# EAGLE design Filter (EAGLE 7.6.0)
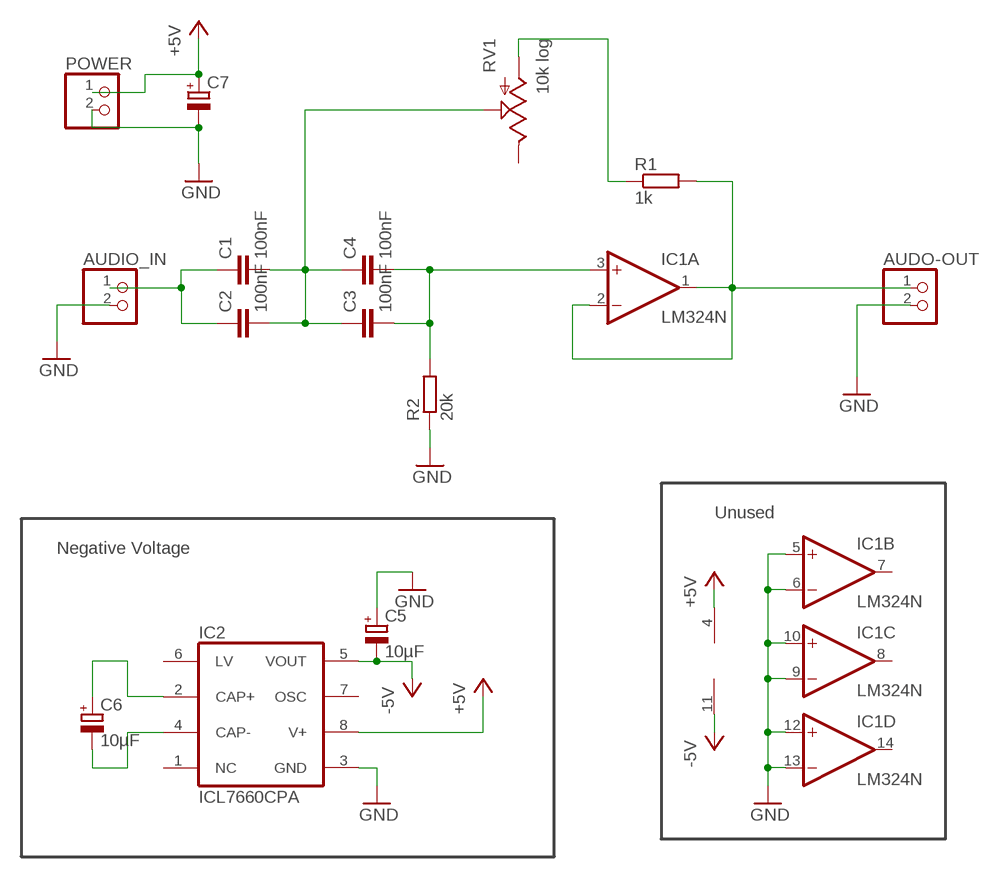
[diagram p0: schematic, sheet 1]

## Parts
AUDIO_IN  PINHD-1X2  [1X02]
AUDO-OUT  PINHD-1X2  [1X02]
C1  100nF  C-EU025-025X050  [C025-025X050]
C2  100nF  C-EU025-025X050  [C025-025X050]
C3  100nF  C-EU025-025X050  [C025-025X050]
C4  100nF  C-EU025-025X050  [C025-025X050]
C5  10µF  CPOL-EUE2.5-6  [E2,5-6]
C6  10µF  CPOL-EUE2.5-6  [E2,5-6]
C7  CPOL-EUE2.5-6  [E2,5-6]
IC1  LM324N  [DIL14]
IC2  ICL7660CPA  [DIL08]
POWER  PINHD-1X2  [1X02]
R1  1k  R-EU_0207/7  [0207/7]
R2  20k  R-EU_0207/7  [0207/7]
RV1  10k log  POT  [ALPS_POT]

## Nets
+5V: C7.+ IC1.4(P:V+) IC2.8(V+) POWER.1
-5V: C5.- IC1.11(P:V-) IC2.5(VOUT)
GND: AUDIO_IN.2 AUDO-OUT.2 C5.+ C7.- IC1.5(B:+IN) IC1.6(B:-IN) IC1.9(C:-IN) IC1.10(C:+IN) IC1.12(D:+IN) IC1.13(D:-IN) IC2.3(GND) POWER.2 R2.1
N$1: C3.2 C4.2 IC1.3(A:+IN) R2.2
N$2: AUDIO_IN.1 C1.1 C2.1
N$3: C1.2 C2.2 C3.1 C4.1 RV1.P$2(S)
N$4: AUDO-OUT.1 IC1.1(A:OUT) IC1.2(A:-IN) R1.2
N$5: R1.1 RV1.P$3(A)
N$8: C6.+ IC2.2(CAP+)
N$9: C6.- IC2.4(CAP-)
Unconnected: IC1.7(B:OUT) IC1.8(C:OUT) IC1.14(D:OUT) IC2.1(NC) IC2.6(LV) IC2.7(OSC) RV1.P$1(E)

## Notes on the sheet
- Unused
- Negative Voltage

## Library data of the parts
AUDIO_IN AUDO-OUT POWER = pinhead:PINHD-1X2: PIN HEADER
C1-C4 = resistor:C-EU: CAPACITOR, European symbol
C5-C7 = rcl:CPOL-EU: POLARIZED CAPACITOR, European symbol
IC1 = linear:LM324: OP AMP
IC2 = maxim:ICL7660CPA: VOLTAGE CONVERTER; MF: INTERSIL; MPN: ICL7660CPA; OC_FARNELL: 1018170; OC_NEWARK: 06F7441
R1 R2 = resistor:R-EU_: RESISTOR, European symbol
RV1 = SparkFun-Electromechanical:POT; PROD_ID: RES-09177

## Board
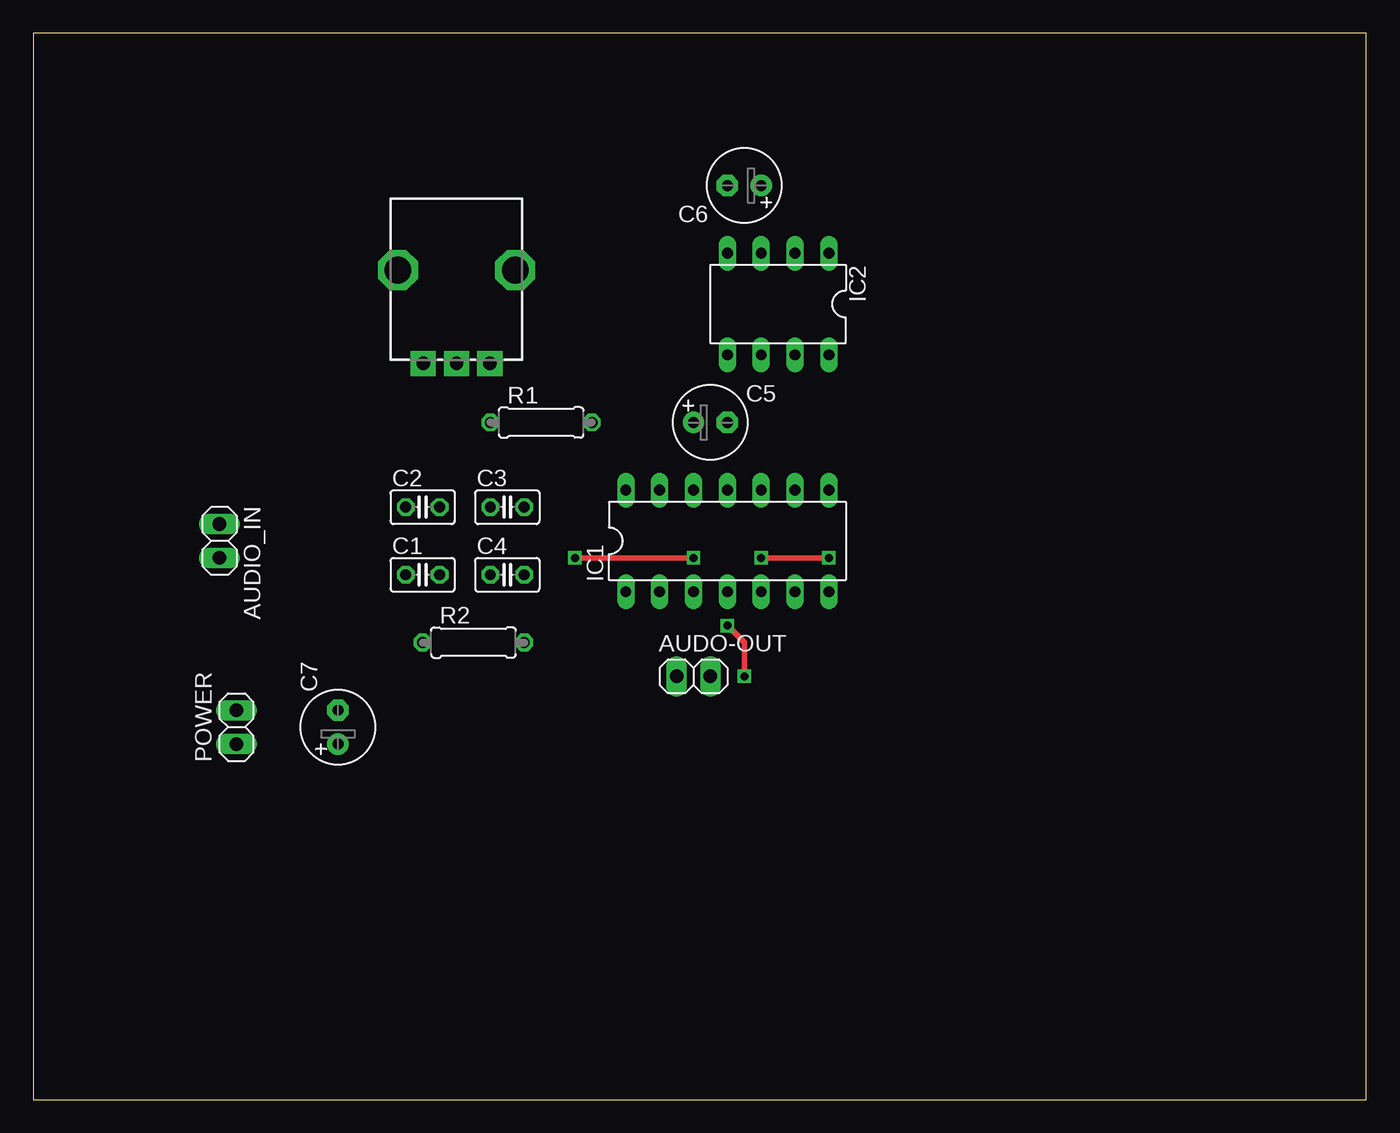
[diagram p1: board, top side]
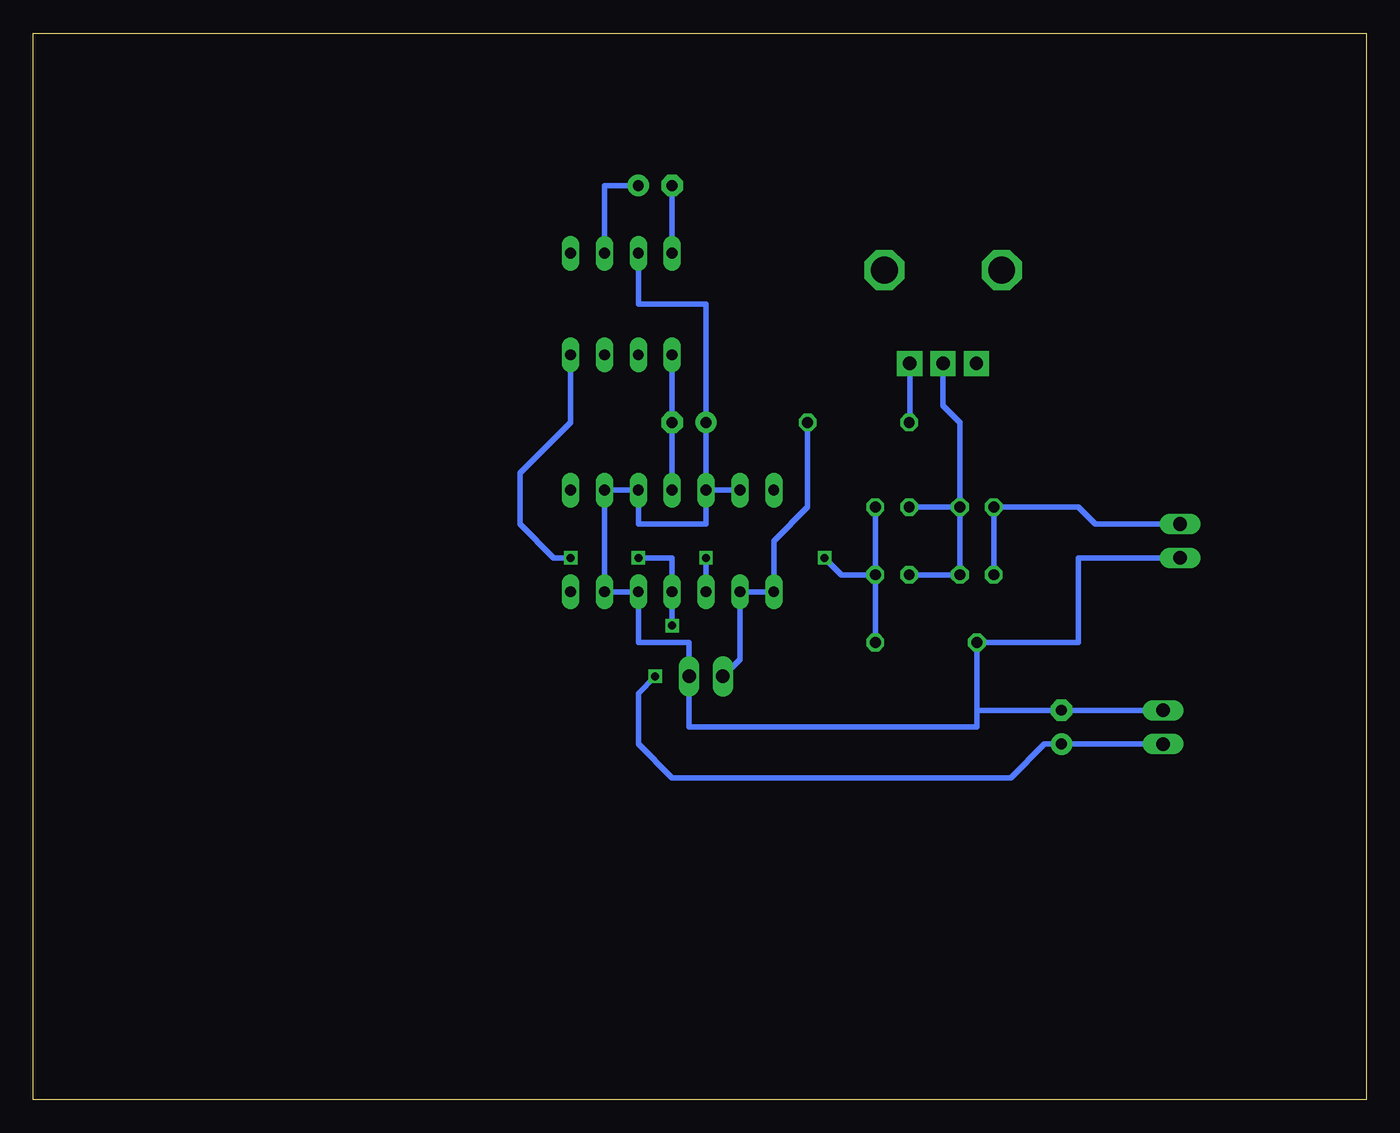
[diagram p2: board, bottom side, seen from below]

Size 100 x 80 mm. Coordinates in mm from the lower left corner, seen from the top.
Outline: 0,0 100,0 100,80 0,80 0,0
Copper layers (1*16): Top 0.035mm / dielectric 1.5mm / Bottom 0.035mm
Design rules "default": minimum track width 10mil, minimum drill 24mil, track to track 8mil, track to pad 8mil, pad to pad 8mil, via to via 8mil, smd to smd 8mil, copper to edge 40mil, drill to drill 8mil, minimum pad ring 10mil, minimum via ring 8mil, stop-mask expansion 4mil, vias tented up to drill 0mil, thermal gap 10mil

### Footprints (pad centres in the part's own frame; a part is rotated, then mirrored left to right if it is on the bottom)
1X02 = drill 1.016 long: 1 -1.27,0; 2 1.27,0
C025-025X050 = drill 0.813 octagon: 1 -1.27,0; 2 1.27,0
E2,5-6 = drill 0.813 pad 1.6: + -1.27,0 | drill 0.813 pad 1.6 octagon: - 1.27,0
DIL14 = drill 0.813 long: 1 -7.62,-3.81; 2 -5.08,-3.81; 3 -2.54,-3.81; 4 0,-3.81; 5 2.54,-3.81; 6 5.08,-3.81; 7 7.62,-3.81; 8 7.62,3.81; 9 5.08,3.81; 10 2.54,3.81; 11 0,3.81; 12 -2.54,3.81; 13 -5.08,3.81; 14 -7.62,3.81
DIL08 = drill 0.813 long: 1 -3.81,-3.81; 2 -1.27,-3.81; 3 1.27,-3.81; 4 3.81,-3.81; 5 3.81,3.81; 6 1.27,3.81; 7 -1.27,3.81; 8 -3.81,3.81
0207/7 = drill 0.813 octagon: 1 -3.81,0; 2 3.81,0
ALPS_POT = drill 1 pad 1.88 square: P$1 7,-2.5; P$2 7,0; P$3 7,2.5 | drill 2 octagon: P$4 0,-4.4; P$5 0,4.4

### Placement (x,y rotation side)
AUDIO_IN  13.97,41.91 270 top
AUDO-OUT  49.53,31.75 0 top
C1  29.21,39.37 0 top
C2  29.21,44.45 0 top
C3  35.56,44.45 0 top
C4  35.56,39.37 0 top
C5  50.8,50.8 0 top
C6  53.34,68.58 180 top
C7  22.86,27.94 90 top
IC1  52.07,41.91 0 top
IC2  55.88,59.69 180 top
POWER  15.24,27.94 90 top
R1  38.1,50.8 0 top
R2  33.02,34.29 0 top
RV1  31.75,62.23 270 top

### Tracks (layer width: path | path; a pad name or v marks a point on that pad's centre or on a via)
+5V  (via drill 0.6)
  Top 0.406: v54.61,40.64 v59.69,40.64 | v53.34,31.75 53.34,34.29 v52.07,35.56
  Bottom 0.406: v54.61,40.64 52.07,40.64 IC1.4 v52.07,35.56 | v59.69,40.64 60.96,40.64 63.5,43.18 63.5,46.99 59.69,50.8 IC2.8 | POWER.1 C7.+ 24.13,26.67 26.67,24.13 52.07,24.13 54.61,26.67 54.61,30.48 v53.34,31.75
-5V
  Bottom 0.406: IC2.5 C5.- IC1.11
GND
  Bottom 0.406: AUDIO_IN.2 21.59,40.64 21.59,34.29 R2.1 29.21,29.21 | 29.21,29.21 29.21,27.94 50.8,27.94 AUDO-OUT.2 50.8,34.29 54.61,34.29 IC1.5 IC1.6 IC1.9 IC1.10 54.61,43.18 49.53,43.18 IC1.12 | IC1.13 IC1.12 | IC1.12 C5.+ 49.53,59.69 54.61,59.69 IC2.3 | POWER.2 C7.- 29.21,29.21
N$1  (via drill 0.6)
  Top 0.406: v40.64,40.64 v49.53,40.64
  Bottom 0.406: C4.2 C3.2 | C4.2 R2.2 | C4.2 39.37,39.37 v40.64,40.64 | v49.53,40.64 IC1.3
N$2
  Bottom 0.406: C1.1 C2.1 21.59,44.45 20.32,43.18 AUDIO_IN.1
N$3
  Bottom 0.406: C2.2 C1.2 C4.1 | C2.2 C3.1 | RV1.P$2 31.75,52.07 30.48,50.8 C2.2
N$4
  Bottom 0.406: R1.2 41.91,44.45 44.45,41.91 IC1.1 IC1.2 46.99,33.02 AUDO-OUT.1
N$5
  Bottom 0.406: RV1.P$3 34.25,50.84 R1.1
N$8
  Bottom 0.406: C6.+ 57.15,68.58 IC2.2
N$9
  Bottom 0.406: C6.- IC2.4